# Altium project Fibre-Optic-Interface.PrjPcb
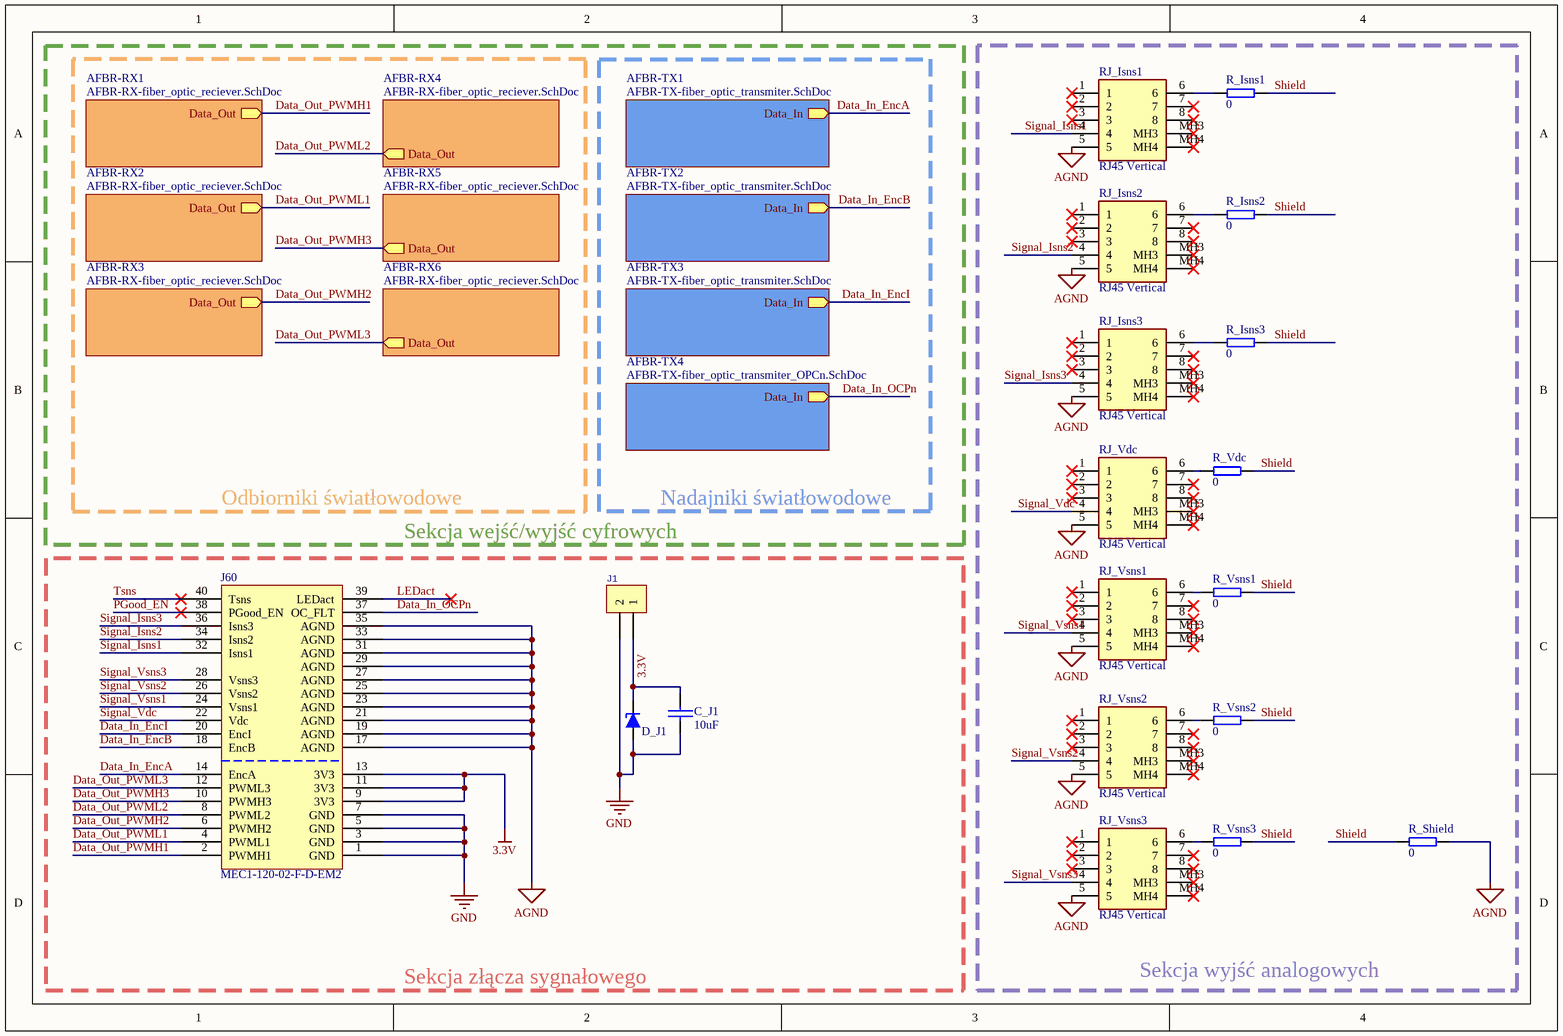
[diagram p0: Fibre-Optic-Interface_main.SchDoc]
4 sheets, 92 parts. Net scope: hierarchical (ports join the sheet entries above them; power ports are global).
Board file: Fibre-Optic-Interface_layout11.PcbDoc
Sheets:
  Fibre-Optic-Interface_main.SchDoc
    AFBR-RX1 = AFBR-RX-fiber_optic_reciever.SchDoc
    AFBR-TX1 = AFBR-TX-fiber_optic_transmiter.SchDoc
    AFBR-RX2 = AFBR-RX-fiber_optic_reciever.SchDoc
    AFBR-RX3 = AFBR-RX-fiber_optic_reciever.SchDoc
    AFBR-RX4 = AFBR-RX-fiber_optic_reciever.SchDoc
    AFBR-RX5 = AFBR-RX-fiber_optic_reciever.SchDoc
    AFBR-RX6 = AFBR-RX-fiber_optic_reciever.SchDoc
    AFBR-TX2 = AFBR-TX-fiber_optic_transmiter.SchDoc
    AFBR-TX3 = AFBR-TX-fiber_optic_transmiter.SchDoc
    AFBR-TX4 = AFBR-TX-fiber_optic_transmiter_OPCn.SchDoc

## Sheet Fibre-Optic-Interface_main.SchDoc
size A4; SheetNumber: 1; SheetTotal: 4

### Parts
C_J1  10uF  [0603C]
D_J1  DIODE_ZENER  [Mini MELF - D]  (value not drawn)
J1  Header_2  [TBG2-3.5MM_H]  (value not drawn)
J60  MEC1-120-02-F-D-EM2  [J60_Connector]
R_Isns1  0  [0603R]
R_Isns2  0  [0603R]
R_Isns3  0  [0603R]
R_Shield  0  [0603R]
R_Vdc  0  [0603R]
R_Vsns1  0  [0603R]
R_Vsns2  0  [0603R]
R_Vsns3  0  [0603R]
RJ_Isns1  RJ45 Vertical  [CUC-SP-J1ST-S/R4LT]
RJ_Isns2  RJ45 Vertical  [CUC-SP-J1ST-S/R4LT]
RJ_Isns3  RJ45 Vertical  [CUC-SP-J1ST-S/R4LT]
RJ_Vdc  RJ45 Vertical  [CUC-SP-J1ST-S/R4LT]
RJ_Vsns1  RJ45 Vertical  [CUC-SP-J1ST-S/R4LT]
RJ_Vsns2  RJ45 Vertical  [CUC-SP-J1ST-S/R4LT]
RJ_Vsns3  RJ45 Vertical  [CUC-SP-J1ST-S/R4LT]

### Blocks framed on the sheet
Sekcja wyjść analogowych: R_Isns1-R_Isns3 R_Shield R_Vdc R_Vsns1-R_Vsns3 RJ_Isns1-RJ_Isns3 RJ_Vdc RJ_Vsns1-RJ_Vsns3

### Sub-sheets
AFBR-RX1 = AFBR-RX-fiber_optic_reciever.SchDoc: Data_Out (out)
AFBR-RX2 = AFBR-RX-fiber_optic_reciever.SchDoc: Data_Out (out)
AFBR-RX3 = AFBR-RX-fiber_optic_reciever.SchDoc: Data_Out (out)
AFBR-RX4 = AFBR-RX-fiber_optic_reciever.SchDoc: Data_Out (out)
AFBR-RX5 = AFBR-RX-fiber_optic_reciever.SchDoc: Data_Out (out)
AFBR-RX6 = AFBR-RX-fiber_optic_reciever.SchDoc: Data_Out (out)
AFBR-TX1 = AFBR-TX-fiber_optic_transmiter.SchDoc: Data_In (out)
AFBR-TX2 = AFBR-TX-fiber_optic_transmiter.SchDoc: Data_In (out)
AFBR-TX3 = AFBR-TX-fiber_optic_transmiter.SchDoc: Data_In (out)
AFBR-TX4 = AFBR-TX-fiber_optic_transmiter_OPCn.SchDoc: Data_In (out)

### Nets
3.3V: C_J1.1 D_J1.K J1.1 J60.9(3V3) J60.11(3V3) J60.13(3V3)
AGND: J60.17(AGND) J60.19(AGND) J60.21(AGND) J60.23(AGND) J60.25(AGND) J60.27(AGND) J60.29(AGND) J60.31(AGND) J60.33(AGND) J60.35(AGND) R_Shield.2 RJ_Isns1.5 RJ_Isns2.5 RJ_Isns3.5 RJ_Vdc.5 RJ_Vsns1.5 RJ_Vsns2.5 RJ_Vsns3.5
GND: C_J1.2 D_J1.A J1.2 J60.1(GND) J60.3(GND) J60.5(GND) J60.7(GND)
Data_In_EncA: J60.14(EncA) ; sheet AFBR-TX1/Data_In
Data_In_EncB: J60.18(EncB) ; sheet AFBR-TX2/Data_In
Data_In_EncI: J60.20(EncI) ; sheet AFBR-TX3/Data_In
Data_In_OCPn: J60.37(OC_FLT) ; sheet AFBR-TX4/Data_In
Data_Out_PWMH1: J60.2(PWMH1) ; sheet AFBR-RX1/Data_Out
Data_Out_PWMH2: J60.6(PWMH2) ; sheet AFBR-RX3/Data_Out
Data_Out_PWMH3: J60.10(PWMH3) ; sheet AFBR-RX5/Data_Out
Data_Out_PWML1: J60.4(PWML1) ; sheet AFBR-RX2/Data_Out
Data_Out_PWML2: J60.8(PWML2) ; sheet AFBR-RX4/Data_Out
Data_Out_PWML3: J60.12(PWML3) ; sheet AFBR-RX6/Data_Out
LEDact: J60.39(LEDact)
PGood_EN: J60.38(PGood_EN)
Shield: R_Isns1.2 R_Isns2.2 R_Isns3.2 R_Shield.1 R_Vdc.2 R_Vsns1.2 R_Vsns2.2 R_Vsns3.2
Signal_Isns1: J60.32(Isns1) RJ_Isns1.4
Signal_Isns2: J60.34(Isns2) RJ_Isns2.4
Signal_Isns3: J60.36(Isns3) RJ_Isns3.4
Signal_Vdc: J60.22(Vdc) RJ_Vdc.4
Signal_Vsns1: J60.24(Vsns1) RJ_Vsns1.4
Signal_Vsns2: J60.26(Vsns2) RJ_Vsns2.4
Signal_Vsns3: J60.28(Vsns3) RJ_Vsns3.4
Tsns: J60.40(Tsns)
NetR_Isns1_1: R_Isns1.1 RJ_Isns1.6
NetR_Isns2_1: R_Isns2.1 RJ_Isns2.6
NetR_Isns3_1: R_Isns3.1 RJ_Isns3.6
NetR_Vdc_1: R_Vdc.1 RJ_Vdc.6
NetR_Vsns1_1: R_Vsns1.1 RJ_Vsns1.6
NetR_Vsns2_1: R_Vsns2.1 RJ_Vsns2.6
NetR_Vsns3_1: R_Vsns3.1 RJ_Vsns3.6

Not connected (* = marked no-connect by the designer): RJ_Isns1 1* 2* 3* 7* 8* MH3* MH4*; RJ_Isns2 1* 2* 3* 7* 8* MH3* MH4*; RJ_Isns3 1* 2* 3* 7* 8* MH3* MH4*; RJ_Vdc 1* 2* 3* 7* 8* MH3* MH4*; RJ_Vsns1 1* 2* 3* 7* 8* MH3* MH4*; RJ_Vsns2 1* 2* 3* 7* 8* MH3* MH4*; RJ_Vsns3 1* 2* 3* 7* 8* MH3* MH4*

### Notes on the sheet
- Odbiorniki światłowodowe
- Nadajniki światłowodowe
- Sekcja wejść/wyjść cyfrowych
- Sekcja złącza sygnałowego

### Library data of the parts
C_J1 = C_1: Capacitor
J60 = Control interface connector: Connector J60
R_Isns1-R_Isns3 R_Shield R_Vdc R_Vsns1-R_Vsns3 = R
RJ_Isns1-RJ_Isns3 RJ_Vdc RJ_Vsns1-RJ_Vsns3 = CUC-SP-J1ST-S/R4LT
J1 = Header_2: PartNumber: *

## Sheet AFBR-RX-fiber_optic_reciever.SchDoc
size A4; SheetNumber: 2; SheetTotal: 3
Used 6 times, as channels AFBR-RX1, AFBR-RX2, AFBR-RX3, AFBR-RX4, AFBR-RX5, AFBR-RX6. Parts and nets are listed once, with the designators drawn on the sheet.
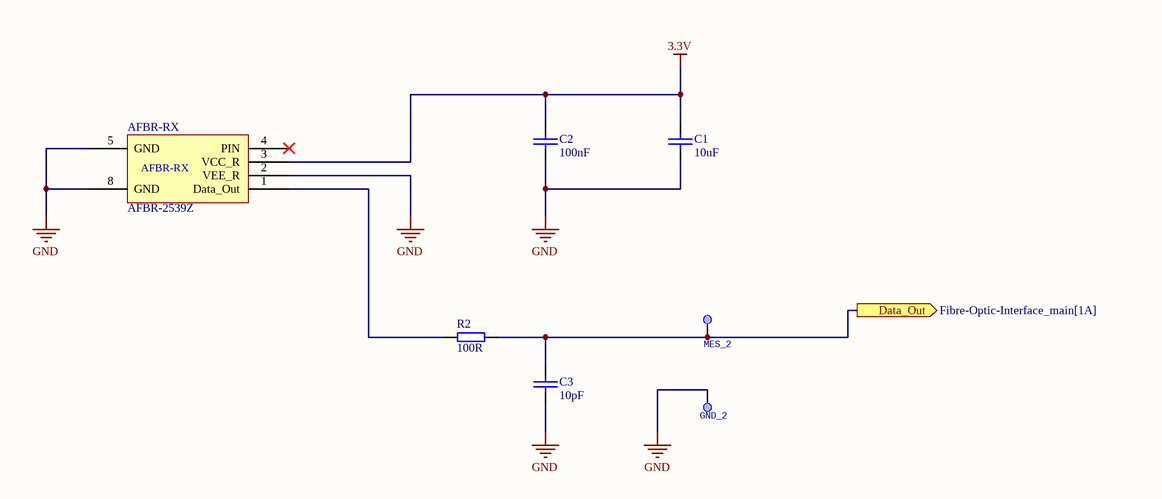
[diagram p1: AFBR-RX-fiber_optic_reciever.SchDoc]

### Parts
AFBR-RX  AFBR-2539Z  [AFBR-TX/RX-HORIZONTAL]
C1  10uF  [1206]
C2  100nF  [0603C]
C3  10pF  [0603C]
GND_2  PK_1  [PK]  (value not drawn)  (no BOM)
MES_2  PK_1  [PK]  (value not drawn)  (no BOM)
R2  100R  [0603R]

### Ports
Data_Out (out, see Fibre-Optic-Interface_main[1A])

### Nets
3.3V: AFBR-RX.3(VCC_R) C1.1 C2.1
GND: AFBR-RX.2(VEE_R) AFBR-RX.5(GND) AFBR-RX.8(GND) C1.2 C2.2 C3.2 GND_2.1
Data_Out: C3.1 MES_2.1 R2.2 ; port Data_Out
NetAFBR-RX_1: AFBR-RX.1(Data_Out) R2.1

Not connected (* = marked no-connect by the designer): AFBR-RX 4(PIN)*

### Channels
AFBR-RX1: designators end in _1; ports Data_Out=Data_Out_PWMH1
AFBR-RX2: designators end in _2; ports Data_Out=Data_Out_PWML1
AFBR-RX3: designators end in _3; ports Data_Out=Data_Out_PWMH2
AFBR-RX4: designators end in _4; ports Data_Out=Data_Out_PWML2
AFBR-RX5: designators end in _5; ports Data_Out=Data_Out_PWMH3
AFBR-RX6: designators end in _6; ports Data_Out=Data_Out_PWML3

### Library data of the parts
AFBR-RX = AFBR-RX: Fiber Optic Transmitters, Receivers, Transceivers VL V 50MBd RX inv
C1 = C_1: Capacitor
C2 = C: Capacitor
C3 = C_3: Capacitor
GND_2 MES_2 = PK_1: Punkt; ClassName: Mechanical
R2 = R_1

## Sheet AFBR-TX-fiber_optic_transmiter.SchDoc
size A4; SheetNumber: 3; SheetTotal: 3
Used 3 times, as channels AFBR-TX1, AFBR-TX2, AFBR-TX3. Parts and nets are listed once, with the designators drawn on the sheet.
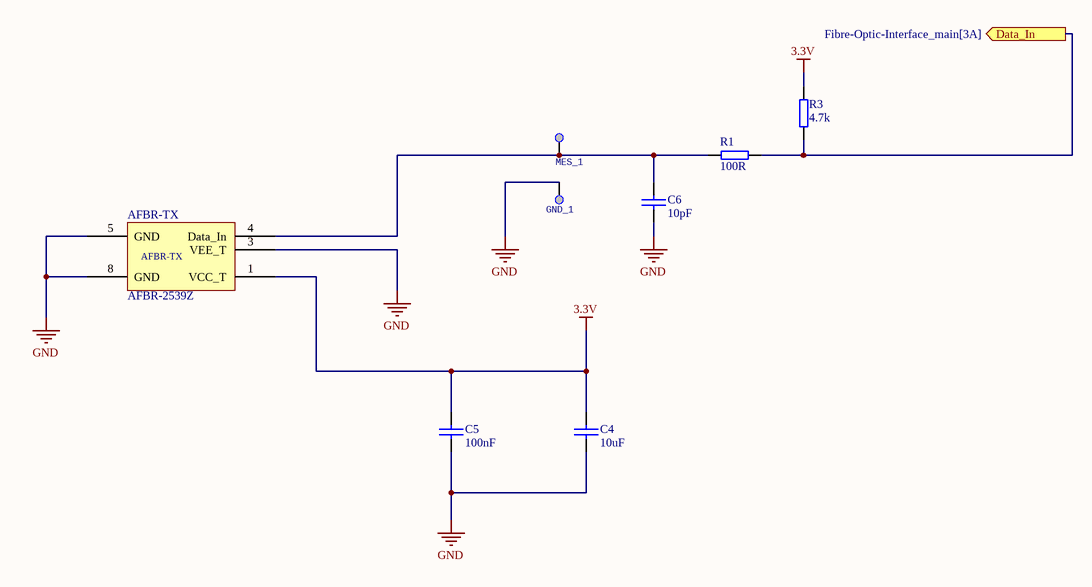
[diagram p2: AFBR-TX-fiber_optic_transmiter.SchDoc]

### Parts
AFBR-TX  AFBR-2539Z  [AFBR-TX/RX-HORIZONTAL]
C4  10uF  [1206]
C5  100nF  [0603C]
C6  10pF  [0603C]
GND_1  PK_1  [PK]  (value not drawn)  (no BOM)
MES_1  PK_1  [PK]  (value not drawn)  (no BOM)
R1  100R  [0603R]
R3  4.7k  [0603R]

### Ports
Data_In (out, see Fibre-Optic-Interface_main[3A])

### Nets
3.3V: AFBR-TX.1(VCC_T) C4.1 C5.1 R3.2
GND: AFBR-TX.3(VEE_T) AFBR-TX.5(GND) AFBR-TX.8(GND) C4.2 C5.2 C6.2 GND_1.1
Data_In: R1.2 R3.1 ; port Data_In
NetAFBR-TX_4: AFBR-TX.4(Data_In) C6.1 MES_1.1 R1.1

### Channels
AFBR-TX1: designators end in _1; ports Data_In=Data_In_EncA
AFBR-TX2: designators end in _2; ports Data_In=Data_In_EncB
AFBR-TX3: designators end in _3; ports Data_In=Data_In_EncI

### Library data of the parts
AFBR-TX = AFBR-TX: Fiber Optic Transmitters, Receivers, Transceivers VL V 50MBd RX inv
C4 = C_1: Capacitor
C5 = C: Capacitor
C6 = C_3: Capacitor
GND_1 MES_1 = PK_1: Punkt; ClassName: Mechanical
R1 = R_1
R3 = R

## Sheet AFBR-TX-fiber_optic_transmiter_OPCn.SchDoc
size A4; SheetNumber: 4; SheetTotal: 4
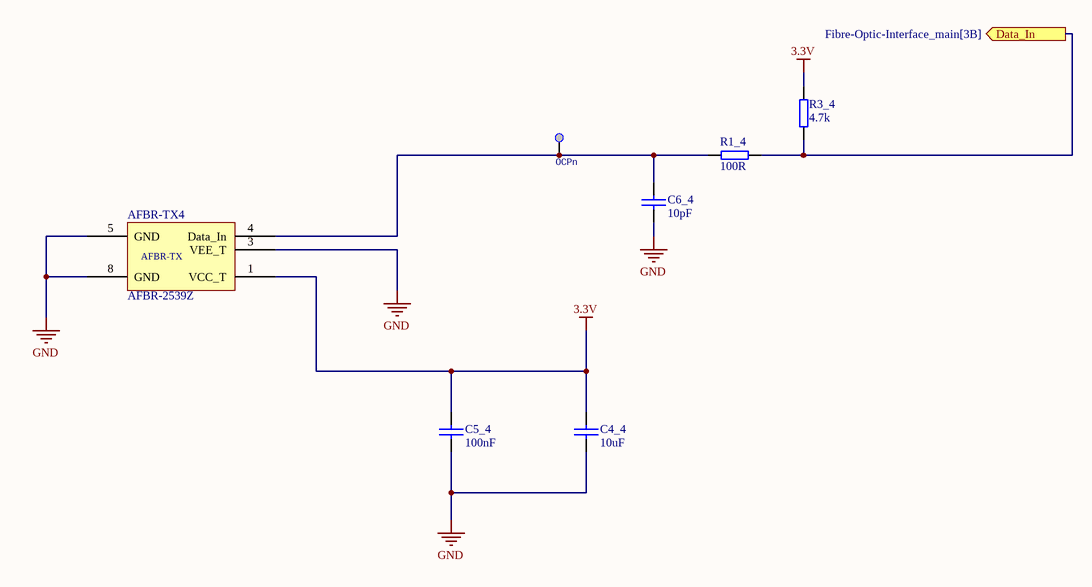
[diagram p3: AFBR-TX-fiber_optic_transmiter_OPCn.SchDoc]

### Parts
AFBR-TX4  AFBR-2539Z  [AFBR-TX/RX-HORIZONTAL]
C4_4  10uF  [1206]
C5_4  100nF  [0603C]
C6_4  10pF  [0603C]
OCPn  PK_1  [PK]  (value not drawn)  (no BOM)
R1_4  100R  [0603R]
R3_4  4.7k  [0603R]

### Ports
Data_In (out, see Fibre-Optic-Interface_main[3B])

### Nets
3.3V: AFBR-TX4.1(VCC_T) C4_4.1 C5_4.1 R3_4.2
GND: AFBR-TX4.3(VEE_T) AFBR-TX4.5(GND) AFBR-TX4.8(GND) C4_4.2 C5_4.2 C6_4.2
Data_In_OCPn: R1_4.2 R3_4.1 ; port Data_In
NetAFBR-TX4_4: AFBR-TX4.4(Data_In) C6_4.1 OCPn.1 R1_4.1

### Library data of the parts
AFBR-TX4 = AFBR-TX: as AFBR-TX on sheet AFBR-TX-fiber_optic_transmiter
C4_4 = C_1: Capacitor
C5_4 = C: Capacitor
C6_4 = C_3: Capacitor
OCPn = PK_1: Punkt; ClassName: Mechanical
R1_4 = R_1
R3_4 = R

## Nets that join several sheets
3.3V: Fibre-Optic-Interface_main (6 pins), AFBR-RX1 (AFBR-RX_1.3 C1_1.1 C2_1.1), AFBR-TX1 (AFBR-TX_1.1 C4_1.1 C5_1.1 R3_1.2), AFBR-RX2 (AFBR-RX_2.3 C1_2.1 C2_2.1), AFBR-RX3 (AFBR-RX_3.3 C1_3.1 C2_3.1), AFBR-RX4 (AFBR-RX_4.3 C1_4.1 C2_4.1), AFBR-RX5 (AFBR-RX_5.3 C1_5.1 C2_5.1), AFBR-RX6 (AFBR-RX_6.3 C1_6.1 C2_6.1), AFBR-TX2 (AFBR-TX_2.1 C4_2.1 C5_2.1 R3_2.2), AFBR-TX3 (AFBR-TX_3.1 C4_3.1 C5_3.1 R3_3.2), AFBR-TX-fiber_optic_transmiter_OPCn (AFBR-TX4.1 C4_4.1 C5_4.1 R3_4.2)
GND: Fibre-Optic-Interface_main (7 pins), AFBR-RX1 (7 pins), AFBR-TX1 (7 pins), AFBR-RX2 (7 pins), AFBR-RX3 (7 pins), AFBR-RX4 (7 pins), AFBR-RX5 (7 pins), AFBR-RX6 (7 pins), AFBR-TX2 (7 pins), AFBR-TX3 (7 pins), AFBR-TX-fiber_optic_transmiter_OPCn (6 pins)
Data_In_EncA: Fibre-Optic-Interface_main (J60.14), AFBR-TX1 (R1_1.2 R3_1.1)
Data_In_EncB: Fibre-Optic-Interface_main (J60.18), AFBR-TX2 (R1_2.2 R3_2.1)
Data_In_EncI: Fibre-Optic-Interface_main (J60.20), AFBR-TX3 (R1_3.2 R3_3.1)
Data_In_OCPn: Fibre-Optic-Interface_main (J60.37), AFBR-TX-fiber_optic_transmiter_OPCn (R1_4.2 R3_4.1)
Data_Out_PWMH1: Fibre-Optic-Interface_main (J60.2), AFBR-RX1 (C3_1.1 MES_2_1.1 R2_1.2)
Data_Out_PWMH2: Fibre-Optic-Interface_main (J60.6), AFBR-RX3 (C3_3.1 MES_2_3.1 R2_3.2)
Data_Out_PWMH3: Fibre-Optic-Interface_main (J60.10), AFBR-RX5 (C3_5.1 MES_2_5.1 R2_5.2)
Data_Out_PWML1: Fibre-Optic-Interface_main (J60.4), AFBR-RX2 (C3_2.1 MES_2_2.1 R2_2.2)
Data_Out_PWML2: Fibre-Optic-Interface_main (J60.8), AFBR-RX4 (C3_4.1 MES_2_4.1 R2_4.2)
Data_Out_PWML3: Fibre-Optic-Interface_main (J60.12), AFBR-RX6 (C3_6.1 MES_2_6.1 R2_6.2)